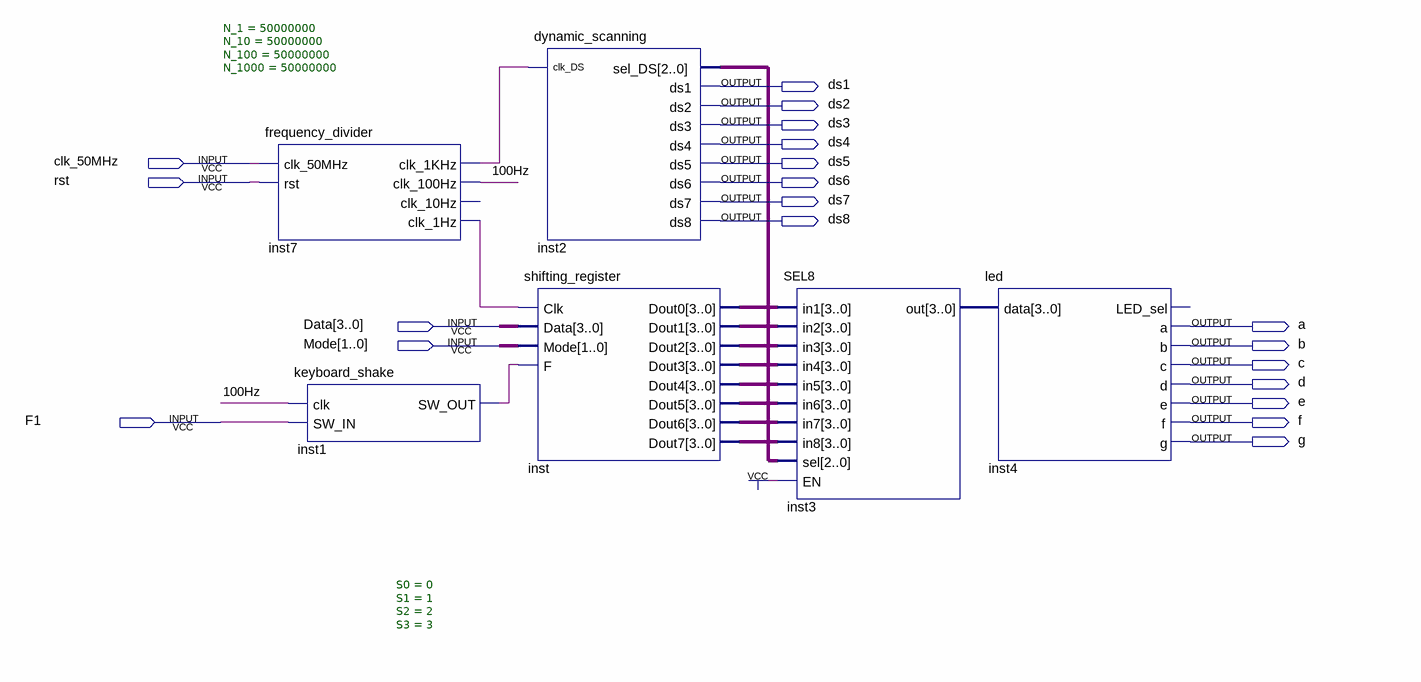
[diagram p0: schematic sheet]
// Quartus schematic project8.bdf as structural Verilog: 6 symbols, 20 pins
module project8 (
  input  clk_50MHz,
  input  rst,
  input  [3:0] Data,
  input  [1:0] Mode,
  input  F1,
  output ds1,
  output ds2,
  output ds3,
  output ds4,
  output ds5,
  output ds6,
  output ds7,
  output ds8,
  output a,
  output b,
  output c,
  output d,
  output e,
  output f,
  output g
);

  wire \100Hz , inst1_sw_out, inst7_clk_1hz, inst7_clk_1khz;
  wire [2:0] inst2_sel_ds;
  wire [3:0] inst3_out, inst_dout0, inst_dout1, inst_dout2, inst_dout3, inst_dout4, inst_dout5, inst_dout6,
       inst_dout7;

  frequency_divider #(.N_1(50000000), .N_10(50000000), .N_100(50000000), .N_1000(50000000)) inst7 (
    .clk_50MHz(clk_50MHz), .rst(rst), .clk_1KHz(inst7_clk_1khz), .clk_100Hz(\100Hz ), .clk_1Hz(inst7_clk_1hz));  // open: clk_10Hz
  keyboard_shake #(.S0(0), .S1(1), .S2(2), .S3(3)) inst1 (.clk(\100Hz ), .SW_IN(F1), .SW_OUT(inst1_sw_out));
  dynamic_scanning inst2 (
    .clk_DS(inst7_clk_1khz), .sel_DS(inst2_sel_ds), .ds1(ds1), .ds2(ds2), .ds3(ds3), .ds4(ds4), .ds5(ds5),
    .ds6(ds6), .ds7(ds7), .ds8(ds8));
  shifting_register inst (
    .Clk(inst7_clk_1hz), .Data(Data), .Mode(Mode), .F(inst1_sw_out), .Dout0(inst_dout0), .Dout1(inst_dout1),
    .Dout2(inst_dout2), .Dout3(inst_dout3), .Dout4(inst_dout4), .Dout5(inst_dout5), .Dout6(inst_dout6),
    .Dout7(inst_dout7));
  SEL8 inst3 (
    .in1(inst_dout0), .in2(inst_dout1), .in3(inst_dout2), .in4(inst_dout3), .in5(inst_dout4),
    .in6(inst_dout5), .in7(inst_dout6), .in8(inst_dout7), .sel(inst2_sel_ds), .EN(1'b1), .out(inst3_out));
  led inst4 (.data(inst3_out), .a(a), .b(b), .c(c), .d(d), .e(e), .f(f), .g(g));  // open: LED_sel
endmodule
